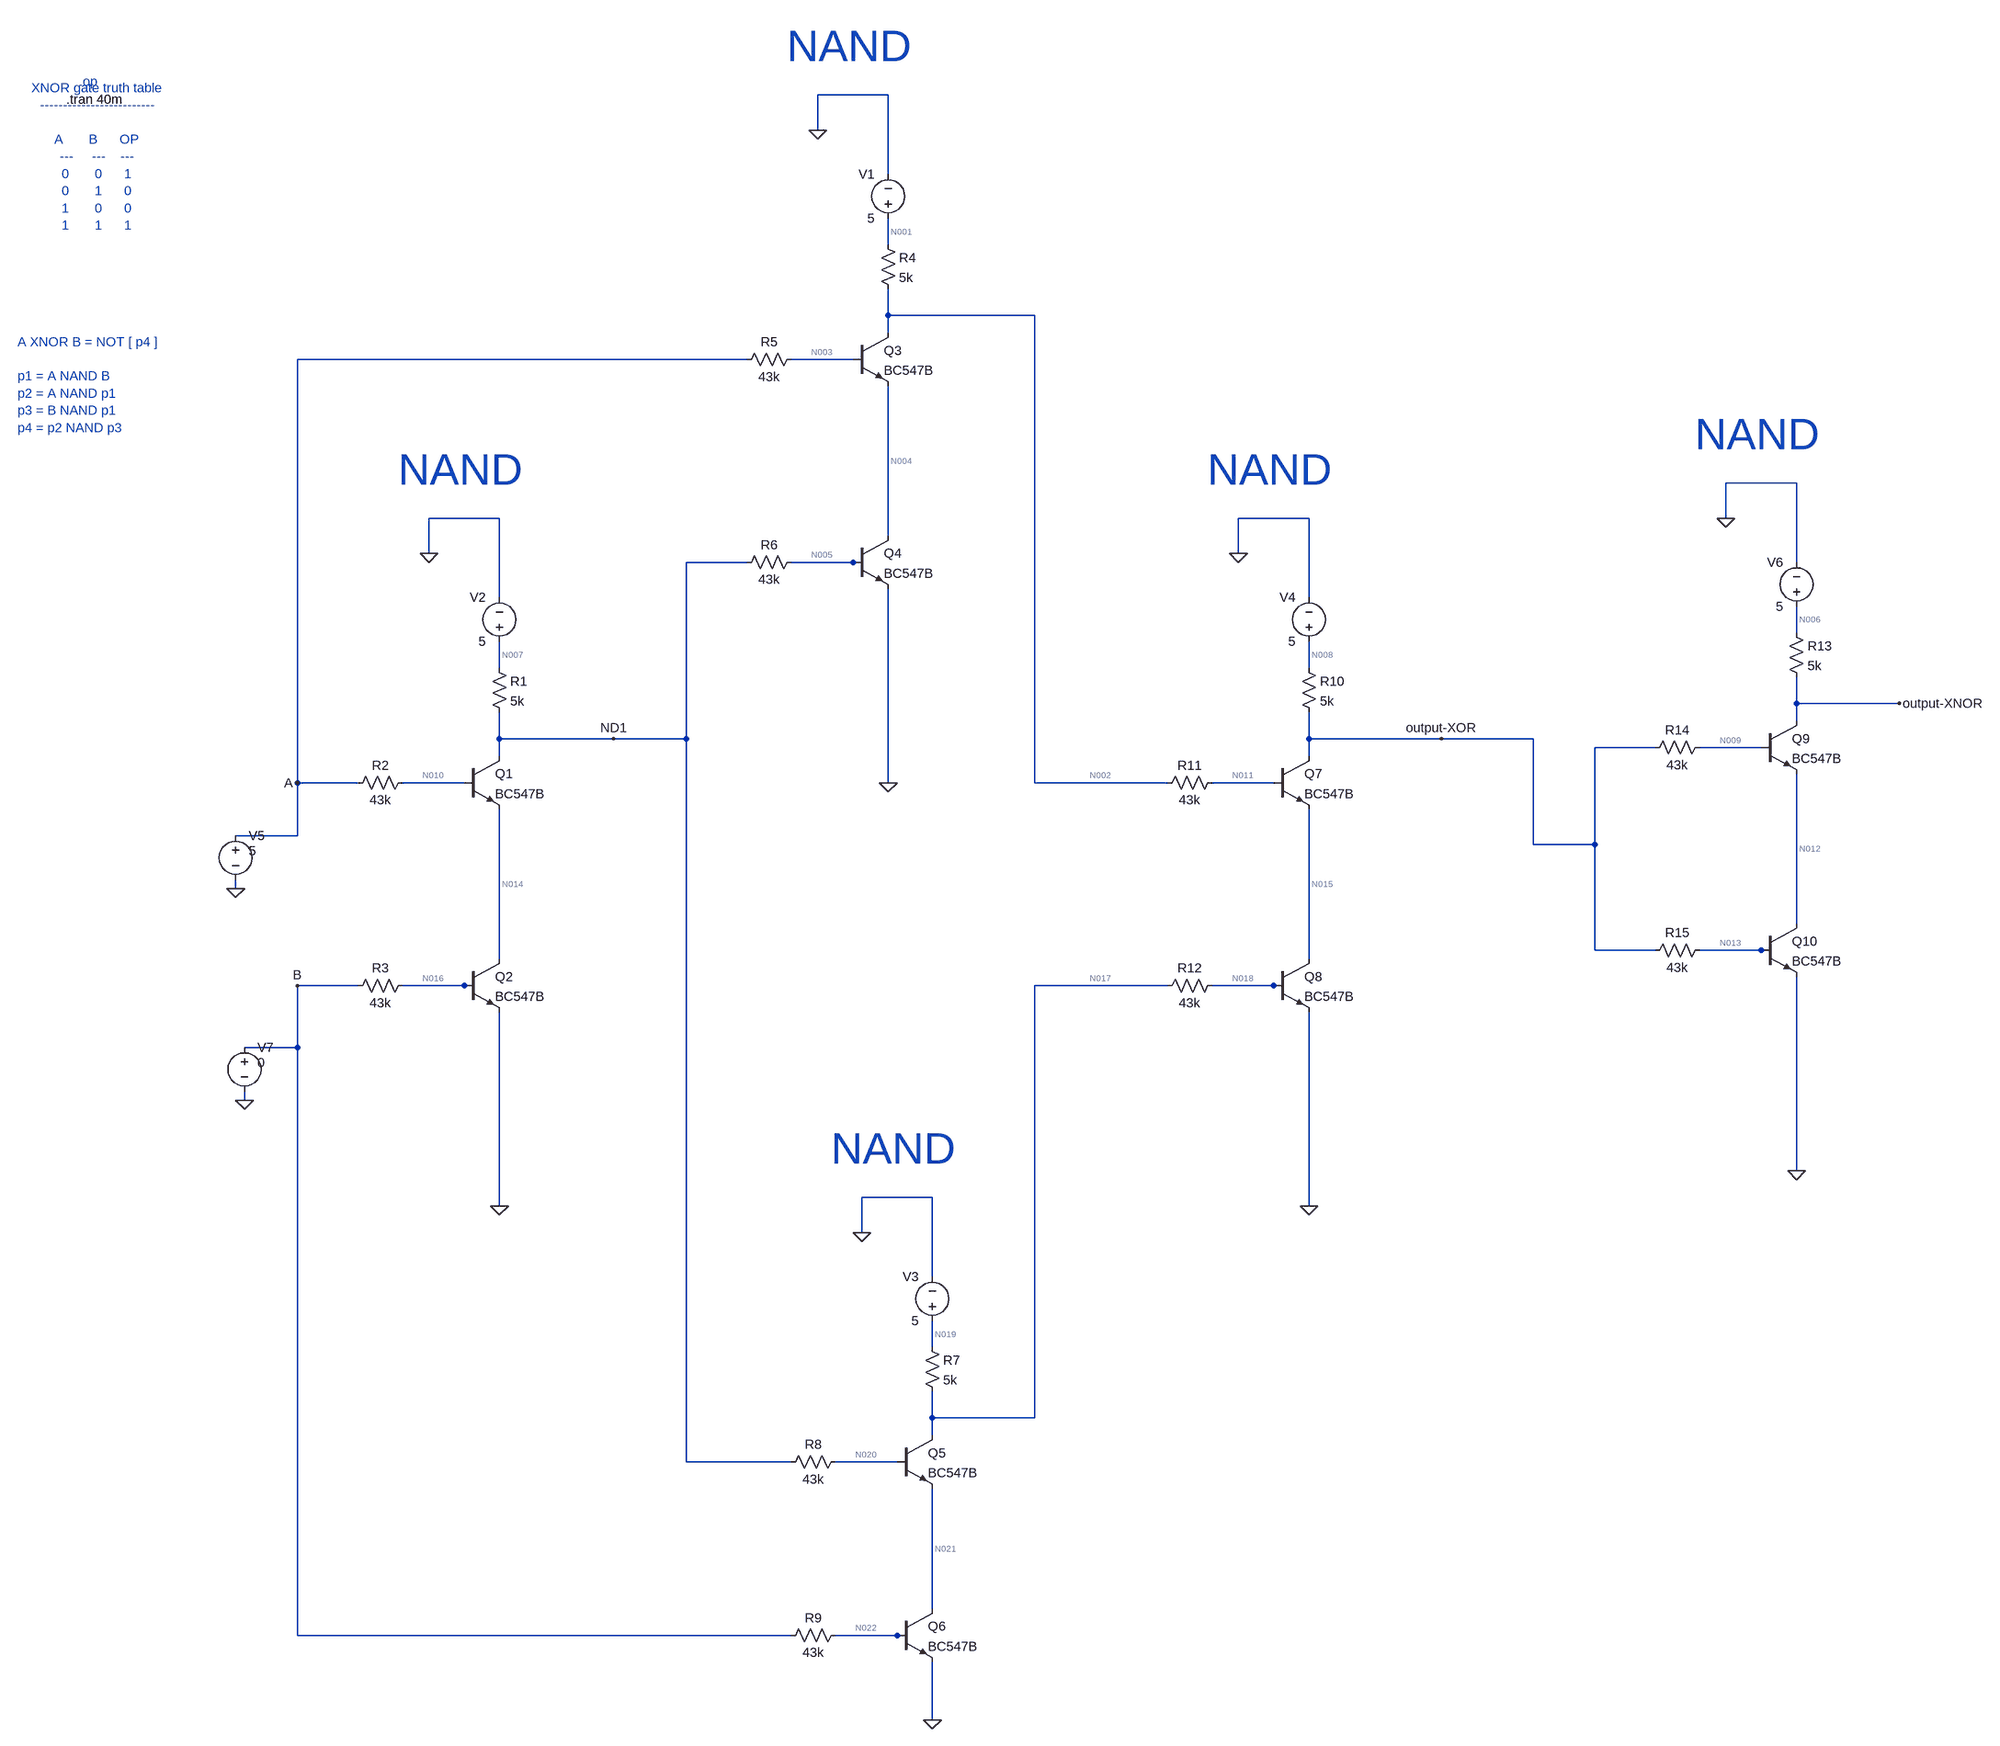
[diagram p0: schematic XNOR_gate_using_NAND_gate.asc]
XNOR_gate_using_NAND_gate.asc, the LTspice schematic file:
Version 4.1
SHEET 1 3052 2404
WIRE -288 -1104 -416 -1104
WIRE -416 -1040 -416 -1104
WIRE -288 -960 -288 -1104
WIRE -288 -832 -288 -880
WIRE -288 -704 -288 -752
WIRE 336 -704 -288 -704
WIRE -288 -672 -288 -704
WIRE -544 -624 -2096 -624
WIRE -352 -624 -464 -624
WIRE 2624 -400 2496 -400
WIRE -1728 -336 -1856 -336
WIRE 1280 -336 1152 -336
WIRE 2496 -336 2496 -400
WIRE -288 -304 -288 -576
WIRE -1856 -272 -1856 -336
WIRE 1152 -272 1152 -336
WIRE -544 -256 -1136 -256
WIRE -352 -256 -464 -256
WIRE -336 -256 -352 -256
WIRE 2624 -256 2624 -400
WIRE -1728 -192 -1728 -336
WIRE 1280 -192 1280 -336
WIRE 2624 -128 2624 -176
WIRE -1728 -64 -1728 -112
WIRE 1280 -64 1280 -112
WIRE 2624 0 2624 -48
WIRE 2864 0 2624 0
WIRE 2624 32 2624 0
WIRE -1728 64 -1728 16
WIRE -1488 64 -1728 64
WIRE -1136 64 -1136 -256
WIRE -1136 64 -1488 64
WIRE 1280 64 1280 16
WIRE 1520 64 1280 64
WIRE 1888 64 1520 64
WIRE 2368 80 2080 80
WIRE 2560 80 2448 80
WIRE -1728 96 -1728 64
WIRE 1280 96 1280 64
WIRE -2096 144 -2096 -624
WIRE -1984 144 -2096 144
WIRE -1792 144 -1904 144
WIRE -288 144 -288 -208
WIRE 336 144 336 -704
WIRE 1024 144 336 144
WIRE 1216 144 1104 144
WIRE -2096 240 -2096 144
WIRE -2096 240 -2208 240
WIRE 1888 256 1888 64
WIRE 2080 256 2080 80
WIRE 2080 256 1888 256
WIRE -2208 336 -2208 320
WIRE 2624 400 2624 128
WIRE 2080 448 2080 256
WIRE 2368 448 2080 448
WIRE 2560 448 2448 448
WIRE 2576 448 2560 448
WIRE -1728 464 -1728 192
WIRE 1280 464 1280 192
WIRE -1984 512 -2096 512
WIRE -1792 512 -1904 512
WIRE -1776 512 -1792 512
WIRE 1024 512 336 512
WIRE 1216 512 1104 512
WIRE 1232 512 1216 512
WIRE -2096 624 -2096 512
WIRE -2096 624 -2192 624
WIRE -2192 720 -2192 704
WIRE 2624 848 2624 496
WIRE -208 896 -336 896
WIRE -1728 912 -1728 560
WIRE 1280 912 1280 560
WIRE -336 960 -336 896
WIRE -208 1040 -208 896
WIRE -208 1168 -208 1120
WIRE -208 1296 -208 1248
WIRE 336 1296 336 512
WIRE 336 1296 -208 1296
WIRE -208 1328 -208 1296
WIRE -1136 1376 -1136 64
WIRE -464 1376 -1136 1376
WIRE -272 1376 -384 1376
WIRE -208 1696 -208 1424
WIRE -2096 1744 -2096 624
WIRE -464 1744 -2096 1744
WIRE -272 1744 -384 1744
WIRE -256 1744 -272 1744
WIRE -208 2144 -208 1792
FLAG -2096 144 A
FLAG -1856 -272 0
FLAG -1488 64 ND1
FLAG -1728 912 0
FLAG -2096 512 B
FLAG -2208 336 0
FLAG -2192 720 0
FLAG -416 -1040 0
FLAG -288 144 0
FLAG -336 960 0
FLAG -208 2144 0
FLAG 1152 -272 0
FLAG 1520 64 output-XOR
FLAG 1280 912 0
FLAG 2496 -336 0
FLAG 2864 0 output-XNOR
FLAG 2624 848 0
SYMBOL npn -1792 96 R0
SYMATTR InstName Q1
SYMATTR Value BC547B
SYMBOL voltage -1728 -96 R180
WINDOW 0 24 96 Left 2
WINDOW 3 24 16 Left 2
WINDOW 123 0 0 Left 0
WINDOW 39 0 0 Left 0
SYMATTR InstName V2
SYMATTR Value 5
SYMBOL res -1744 -80 R0
SYMATTR InstName R1
SYMATTR Value 5k
SYMBOL res -1888 128 R90
WINDOW 0 0 56 VBottom 2
WINDOW 3 32 56 VTop 2
SYMATTR InstName R2
SYMATTR Value 43k
SYMBOL npn -1792 464 R0
SYMATTR InstName Q2
SYMATTR Value BC547B
SYMBOL res -1888 496 R90
WINDOW 0 0 56 VBottom 2
WINDOW 3 32 56 VTop 2
SYMATTR InstName R3
SYMATTR Value 43k
SYMBOL voltage -2208 224 R0
WINDOW 3 24 44 Left 2
WINDOW 123 0 0 Left 0
WINDOW 39 0 0 Left 0
SYMATTR Value 5
SYMATTR InstName V5
SYMBOL voltage -2192 608 R0
WINDOW 3 24 44 Left 2
WINDOW 123 0 0 Left 0
WINDOW 39 0 0 Left 0
SYMATTR Value 0
SYMATTR InstName V7
SYMBOL npn -352 -672 R0
SYMATTR InstName Q3
SYMATTR Value BC547B
SYMBOL voltage -288 -864 R180
WINDOW 0 24 96 Left 2
WINDOW 3 24 16 Left 2
WINDOW 123 0 0 Left 0
WINDOW 39 0 0 Left 0
SYMATTR InstName V1
SYMATTR Value 5
SYMBOL res -304 -848 R0
SYMATTR InstName R4
SYMATTR Value 5k
SYMBOL res -448 -640 R90
WINDOW 0 0 56 VBottom 2
WINDOW 3 32 56 VTop 2
SYMATTR InstName R5
SYMATTR Value 43k
SYMBOL npn -352 -304 R0
SYMATTR InstName Q4
SYMATTR Value BC547B
SYMBOL res -448 -272 R90
WINDOW 0 0 56 VBottom 2
WINDOW 3 32 56 VTop 2
SYMATTR InstName R6
SYMATTR Value 43k
SYMBOL npn -272 1328 R0
SYMATTR InstName Q5
SYMATTR Value BC547B
SYMBOL voltage -208 1136 R180
WINDOW 0 24 96 Left 2
WINDOW 3 24 16 Left 2
WINDOW 123 0 0 Left 0
WINDOW 39 0 0 Left 0
SYMATTR InstName V3
SYMATTR Value 5
SYMBOL res -224 1152 R0
SYMATTR InstName R7
SYMATTR Value 5k
SYMBOL res -368 1360 R90
WINDOW 0 0 56 VBottom 2
WINDOW 3 32 56 VTop 2
SYMATTR InstName R8
SYMATTR Value 43k
SYMBOL npn -272 1696 R0
SYMATTR InstName Q6
SYMATTR Value BC547B
SYMBOL res -368 1728 R90
WINDOW 0 0 56 VBottom 2
WINDOW 3 32 56 VTop 2
SYMATTR InstName R9
SYMATTR Value 43k
SYMBOL npn 1216 96 R0
SYMATTR InstName Q7
SYMATTR Value BC547B
SYMBOL voltage 1280 -96 R180
WINDOW 0 24 96 Left 2
WINDOW 3 24 16 Left 2
WINDOW 123 0 0 Left 0
WINDOW 39 0 0 Left 0
SYMATTR InstName V4
SYMATTR Value 5
SYMBOL res 1264 -80 R0
SYMATTR InstName R10
SYMATTR Value 5k
SYMBOL res 1120 128 R90
WINDOW 0 0 56 VBottom 2
WINDOW 3 32 56 VTop 2
SYMATTR InstName R11
SYMATTR Value 43k
SYMBOL npn 1216 464 R0
SYMATTR InstName Q8
SYMATTR Value BC547B
SYMBOL res 1120 496 R90
WINDOW 0 0 56 VBottom 2
WINDOW 3 32 56 VTop 2
SYMATTR InstName R12
SYMATTR Value 43k
SYMBOL npn 2560 32 R0
SYMATTR InstName Q9
SYMATTR Value BC547B
SYMBOL voltage 2624 -160 R180
WINDOW 0 24 96 Left 2
WINDOW 3 24 16 Left 2
WINDOW 123 0 0 Left 0
WINDOW 39 0 0 Left 0
SYMATTR InstName V6
SYMATTR Value 5
SYMBOL res 2608 -144 R0
SYMATTR InstName R13
SYMATTR Value 5k
SYMBOL res 2464 64 R90
WINDOW 0 0 56 VBottom 2
WINDOW 3 32 56 VTop 2
SYMATTR InstName R14
SYMATTR Value 43k
SYMBOL npn 2560 400 R0
SYMATTR InstName Q10
SYMATTR Value BC547B
SYMBOL res 2464 432 R90
WINDOW 0 0 56 VBottom 2
WINDOW 3 32 56 VTop 2
SYMATTR InstName R15
SYMATTR Value 43k
TEXT -3832 -1096 Left 2 !.tran 40m
TEXT -3808 -1128 Left 2 ;.op
TEXT -3776 -992 Center 2 ;XNOR gate truth table\n-------------------------\n \nA       B      OP\n---     ---    ---\n0       0      1\n0       1      0\n1       0      0\n1       1      1
TEXT -3920 -656 Left 2 ;A XNOR B = NOT [ p4 ]\n \np1 = A NAND B\np2 = A NAND p1\np3 = B NAND p1\np4 = p2 NAND p3
TEXT -1912 -424 Left 6 ;NAND
TEXT -472 -1192 Left 6 ;NAND
TEXT -392 808 Left 6 ;NAND
TEXT 1096 -424 Left 6 ;NAND
TEXT 2440 -488 Left 6 ;NAND

The netlist it stands for:
* XNOR_gate_using_NAND_gate.asc
Q1 ND1 N010 N014 0 BC547B
V2 N007 0 5
R1 N007 ND1 5k
R2 N010 A 43k
Q2 N014 N016 0 0 BC547B
R3 N016 B 43k
V5 A 0 5
V7 B 0 0
Q3 N002 N003 N004 0 BC547B
V1 N001 0 5
R4 N001 N002 5k
R5 N003 A 43k
Q4 N004 N005 0 0 BC547B
R6 N005 ND1 43k
Q5 N017 N020 N021 0 BC547B
V3 N019 0 5
R7 N019 N017 5k
R8 N020 ND1 43k
Q6 N021 N022 0 0 BC547B
R9 N022 B 43k
Q7 output-XOR N011 N015 0 BC547B
V4 N008 0 5
R10 N008 output-XOR 5k
R11 N011 N002 43k
Q8 N015 N018 0 0 BC547B
R12 N018 N017 43k
Q9 output-XNOR N009 N012 0 BC547B
V6 N006 0 5
R13 N006 output-XNOR 5k
R14 N009 output-XOR 43k
Q10 N012 N013 0 0 BC547B
R15 N013 output-XOR 43k
.model NPN NPN
.model PNP PNP
.lib standard.bjt
.tran 40m
* .op
* XNOR gate truth table
* -------------------------
* A       B      OP
* ---     ---    ---
* 0       0      1
* 0       1      0
* 1       0      0
* 1       1      1
* A XNOR B = NOT [ p4 ]
* p1 = A NAND B
* p2 = A NAND p1
* p3 = B NAND p1
* p4 = p2 NAND p3
* NAND
* NAND
* NAND
* NAND
* NAND
.backanno
.end

* Results of the author's LTspice run, read from the files saved beside the schematic
* Operating Point, zero values left out:
*   V(n010) = 4.993 V
*   V(n007) = 5 V
*   V(a) = 5 V
*   V(n004) = 34.53 mV
*   V(n005) = 653.5 mV
*   V(n017) = 4.545 V
*   V(n021) = 4.412 V
*   V(output-xor) = 4.183 V
*   V(n015) = 6.369 mV
*   V(output-xnor) = 70.53 mV
*   V(n012) = 35.94 mV
*   V(n006) = 5 V
*   V(nd1) = 4.548 V
*   V(n014) = 4.546 V
*   V(n016) = 198.3 nV
*   V(n002) = 65.56 mV
*   V(n003) = 687.5 mV
*   V(n001) = 5 V
*   V(n020) = 4.548 V
*   V(n019) = 5 V
*   V(n022) = 192.6 nV
*   V(n011) = 65.56 mV
*   V(n008) = 5 V
*   V(n018) = 627.6 mV
*   V(n009) = 686.6 mV
*   V(n013) = 652.1 mV
*   I(R15) = -82.11 µA
*   Ic(Q1) = -152.8 nA
*   Ib(Q1) = 152.8 nA
*   Ie(Q1) = -4.639 pA
*   I(R3) = 4.612 pA
*   I(R4) = 986.9 µA
*   I(R6) = -90.57 µA
*   I(R1) = 90.42 µA
*   Ic(Q6) = 4.504 pA
*   Ib(Q6) = -4.478 pA
*   I(R11) = 4.111 pA
*   Ic(Q9) = 985.9 µA
*   Ib(Q9) = 81.31 µA
*   Ie(Q9) = -1.067 mA
*   I(R13) = 985.9 µA
*   I(R12) = -91.09 µA
*   Ic(Q2) = 4.638 pA
*   Ib(Q2) = -4.612 pA
*   I(V7) = 9.09 pA
*   Ic(Q7) = 4.429 pA
*   Ib(Q7) = -4.111 pA
*   Ic(Q4) = 1.087 mA
*   Ib(Q4) = 90.57 µA
*   Ie(Q4) = -1.178 mA
*   I(V3) = -91.09 µA
*   I(V5) = -100.4 µA
*   I(V1) = -986.9 µA
*   Ic(Q5) = 4.242 pA
*   Ie(Q5) = -4.504 pA
*   I(R9) = 4.478 pA
*   I(R10) = 163.4 µA
*   I(V2) = -90.42 µA
*   Ic(Q10) = 1.067 mA
*   Ib(Q10) = 82.11 µA
*   Ie(Q10) = -1.149 mA
*   I(V6) = -985.9 µA
*   I(R2) = -152.8 nA
*   I(R5) = -100.3 µA
*   I(R14) = -81.31 µA
*   I(R7) = 91.09 µA
*   Ic(Q3) = 986.9 µA
*   Ib(Q3) = 100.3 µA
*   Ie(Q3) = -1.087 mA
*   I(V4) = -163.4 µA
*   Ib(Q8) = 91.09 µA
*   Ie(Q8) = -91.09 µA